# EAGLE schematic main (EAGLE 7.7.0)
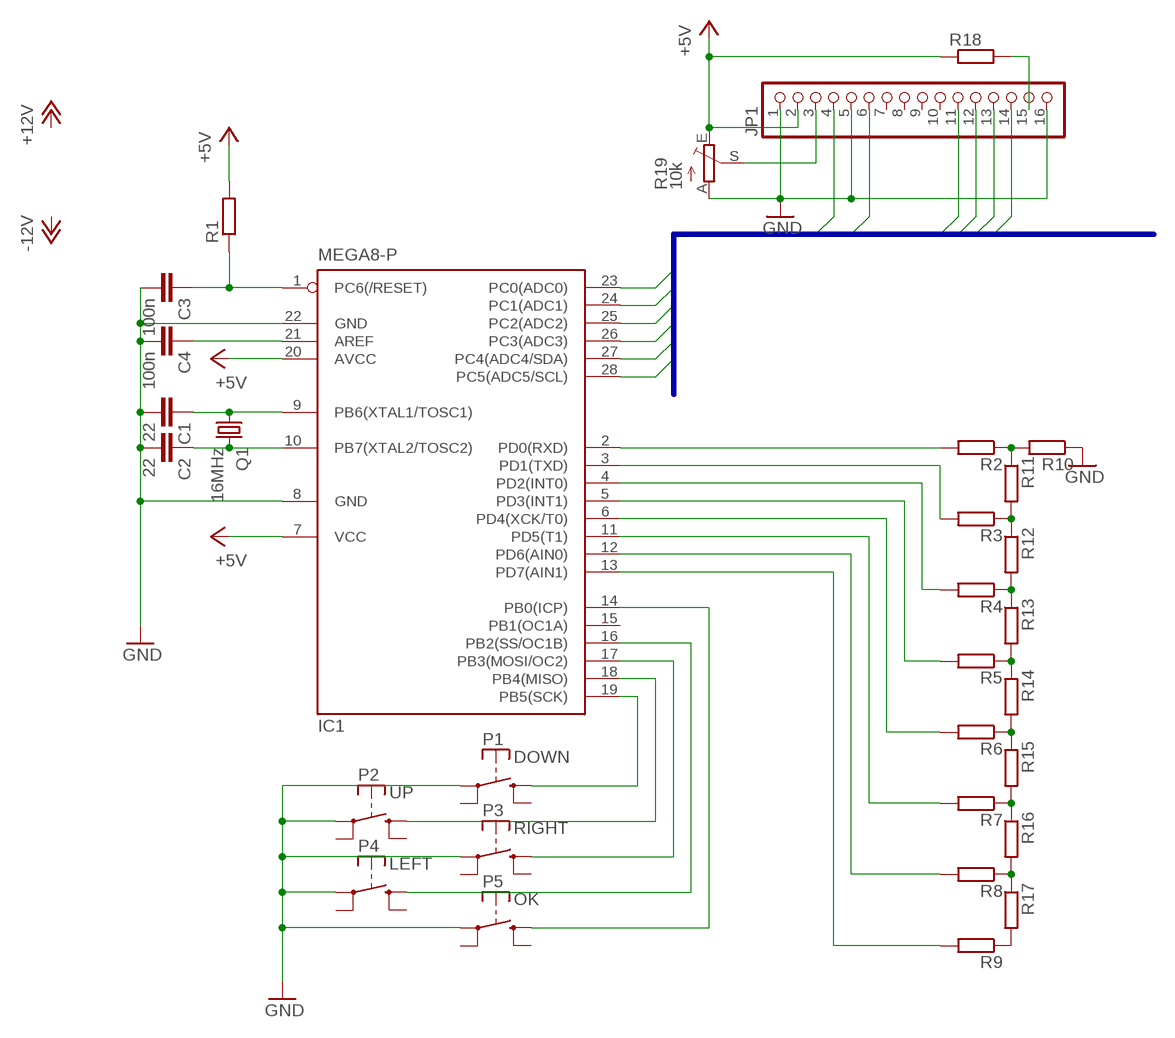
[diagram p0: schematic, sheet 1]

## Parts
C1  22  C-EUC0805  [C0805]
C2  22  C-EUC0805  [C0805]
C3  100n  C-EUC0805  [C0805]
C4  100n  C-EUC0805  [C0805]
IC1  MEGA8-P  [DIL28-3]
JP1  PINHD-1X16  [1X16]
P1  DOWN  FSMCD  [FSMCD]
P2  UP  FSMCD  [FSMCD]
P3  RIGHT  FSMCD  [FSMCD]
P4  LEFT  FSMCD  [FSMCD]
P5  OK  FSMCD  [FSMCD]
Q1  16MHz  CRYSTALHC49S  [HC49/S]
R1  R-EU_0207/10  [0207/10]
R2  R-EU_0207/10  [0207/10]
R3  R-EU_0207/10  [0207/10]
R4  R-EU_0207/10  [0207/10]
R5  R-EU_0207/10  [0207/10]
R6  R-EU_0207/10  [0207/10]
R7  R-EU_0207/10  [0207/10]
R8  R-EU_0207/10  [0207/10]
R9  R-EU_0207/10  [0207/10]
R10  R-EU_0207/10  [0207/10]
R11  R-EU_0207/10  [0207/10]
R12  R-EU_0207/10  [0207/10]
R13  R-EU_0207/10  [0207/10]
R14  R-EU_0207/10  [0207/10]
R15  R-EU_0207/10  [0207/10]
R16  R-EU_0207/10  [0207/10]
R17  R-EU_0207/10  [0207/10]
R18  R-EU_0207/10  [0207/10]
R19  10k  TRIM_EU-CA6V  [CA6V]

## Nets
+5V: IC1.7(VCC) IC1.20(AVCC) JP1.2 R1.2 R18.1 R19.E
GND: C1.2 C2.2 C3.2 C4.2 IC1.8(GND) IC1.22(GND) JP1.1 JP1.5 JP1.16 P1.P$1(P) P2.P$1(P) P3.P$1(P) P4.P$1(P) P5.P$1(P) R10.1 R19.A
LCD_D4: IC1.23(PC0(ADC0)) JP1.11
LCD_D5: IC1.24(PC1(ADC1)) JP1.12
LCD_D6: IC1.25(PC2(ADC2)) JP1.13
LCD_D7: IC1.26(PC3(ADC3)) JP1.14
LCD_E: IC1.28(PC5(ADC5/SCL)) JP1.6
LCD_RS: IC1.27(PC4(ADC4/SDA)) JP1.4
N$1: C1.1 IC1.9(PB6(XTAL1/TOSC1)) Q1.1
N$2: C2.1 IC1.10(PB7(XTAL2/TOSC2)) Q1.2
N$3: IC1.3(PD1(TXD)) R3.2
N$4: C3.1 IC1.1(PC6(/RESET)) R1.1
N$5: IC1.4(PD2(INT0)) R4.2
N$6: C4.1 IC1.21(AREF)
N$7: R2.1 R10.2 R11.1
N$8: R3.1 R11.2 R12.1
N$9: R4.1 R12.2 R13.1
N$10: R5.1 R13.2 R14.1
N$11: R6.1 R14.2 R15.1
N$12: R7.1 R15.2 R16.1
N$13: R8.1 R16.2 R17.1
N$14: R9.1 R17.2
N$15: IC1.5(PD3(INT1)) R5.2
N$16: IC1.6(PD4(XCK/T0)) R6.2
N$17: IC1.11(PD5(T1)) R7.2
N$18: IC1.12(PD6(AIN0)) R8.2
N$19: IC1.13(PD7(AIN1)) R9.2
N$20: IC1.2(PD0(RXD)) R2.2
N$21: JP1.3 R19.S
N$22: JP1.15 R18.2
N$23: IC1.19(PB5(SCK)) P1.P$3(S)
N$24: IC1.18(PB4(MISO)) P2.P$3(S)
N$25: IC1.17(PB3(MOSI/OC2)) P3.P$3(S)
N$26: IC1.16(PB2(SS/OC1B)) P4.P$3(S)
N$27: IC1.14(PB0(ICP)) P5.P$3(S)
Unconnected: IC1.15(PB1(OC1A)) JP1.7 JP1.8 JP1.9 JP1.10 P1.P$2(P) P1.P$4(S) P2.P$2(P) P2.P$4(S) P3.P$2(P) P3.P$4(S) P4.P$2(P) P4.P$4(S) P5.P$2(P) P5.P$4(S)

## Buses
LCD_D[4..7],LCD_RS,LCD_E

## Library data of the parts
C1-C4 = rcl:C-EU: CAPACITOR, European symbol
IC1 = atmel:MEGA8-P: MICROCONTROLLER 8 Kbytes FLASH, 1 kbytes SRAM, 512 bytes EEPROM, USART, 4-channel 10 bit ADC, 2-channel 8 bit ADC Pin compatible with Atmega48, ATMega88, ATMega168 Source: avr.lbr; OC_FARNELL: unknown; OC_NEWARK: unknown
JP1 = pinhead:PINHD-1X16: PIN HEADER
P1-P5 = switch-misc:FSMCD: TYCO SWITCH
Q1 = crystal:CRYSTAL: CRYSTAL; OC_FARNELL: 1667008; OC_NEWARK: unknown
R1-R18 = rcl:R-EU_: RESISTOR, European symbol
R19 = pot:TRIM_EU-: POTENTIOMETER